# EasyEDA Pro project ProPrj_无线即时通信_2025-03-31.epro, board 主控板
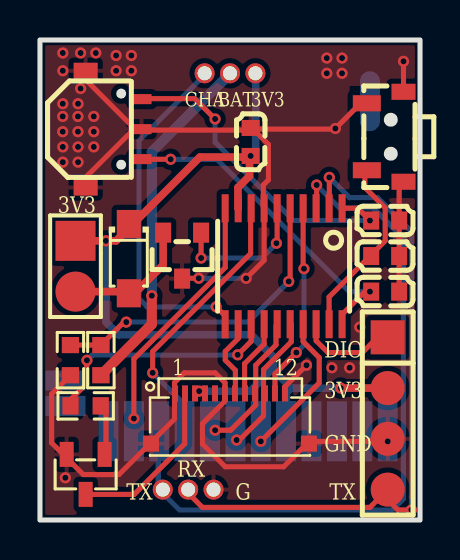
[diagram p6: board, top side]
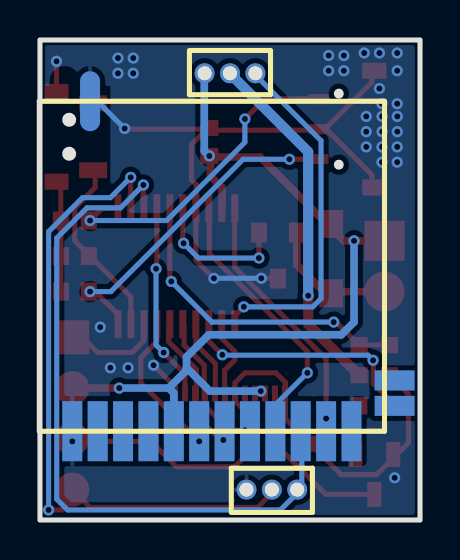
[diagram p7: board, bottom side, seen from below]

Outline 19.02 x 24.02 mm; copper layers: Top Layer, Bottom Layer. Coordinates in mm from the lower left corner of the outline.
Outline path: rectangle 0,24.02 19.02,0
Stack: Top Layer 0.035mm / Dielectric1 0.91mm FR4 er 4.5 / Bottom Layer 0.035mm

## Design rules (mm)
template: JLCPCB Capability(Two Layers Board)
spacing copperThickness1oz (default): track to track 0.102, other pairs 0.152 to 0.3
spacing copperThickness2oz: track to track 0.203, other pairs 0.152 to 0.3
track width copperThickness1oz (default): min 0.127, default 0.254, max 2.54
track width copperThickness2oz: min 0.203, default 0.254, max 2.54
differential pair differentialPair (default): width min 0.127, default 0.254, max 2.54; gap min 0.152, default 0.152
via viaSize (default): diameter min 0.5, default 0.61, max 10; hole min 0.3, default 0.305, max 6.3

## Placement (name value [footprint] x y rotation side)
C2  100nF  [C0603]  10.54 18.92 270 top
C10  100nF  [C0603]  17.27 14.98 0 top
C11  100nF  [C0603]  17.27 11.43 0 top
C56  100nF  [C0603]  17.27 13.2 0 top
D4  DS34W  [SOD-123FL_L2.7-W1.8-LS3.8-RD]  4.44 13.08 270 top
FPC1  AFH34-S12FIA-1H  [FPC-SMD_12P-P0.50_THD0509-12CL-GF]  9.51 5.08 0 top
H1  PZ254V-11-02P  [HDR-TH_2P-P2.54-V-M]  1.78 12.7 270 top
H2  PZ254V-11-04P  [HDR-TH_4P-P2.54-V-M]  17.4 5.33 270 top
Q6  AO3401A  [SOT-23_L2.9-W1.3-P0.95-LS2.4-BR]  7.11 13.23 90 top
R4  100kΩ  [R0603]  3.05 8 270 top
R5  100kΩ  [R0603]  1.52 8 90 top
R62  2.2k  [R0603]  2.29 5.71 0 top
SW3  TS24CA 250gf 013  [SW-SMD_L4.7-W3.5-P3.35-EH]  17.27 19.17 270 top
U1  CH32V003F4P6(TSSOP20)  [OLIMEX_IC-FP:TSSOP20_Pitch-0.65mm_6.6x4.5x1.2mm]  12.19 12.7 180 top
U23  -  [e5e8]  2.54 19.56 90 top
U24  XL1278-SMT  [SX1278]  10.41 12.7 180 bottom
U25  SS8050  [SOT-23-3_L2.9-W1.3-P1.90-LS2.4-BR]  2.29 2.28 90 top
U33  1271WV-3P  [HDR-TH_3P-P1.27-V-M]  9.51 22.35 0 bottom
U34  1271WV-3P  [HDR-TH_3P-P1.27-V-M]  7.41 1.52 180 bottom

## Footprints (pads in the part's own frame, mm; a bottom-side part is the same pattern mirrored in y, then rotated)
C0603
  rect 0.8x0.9 smd: 1(-0.7,0) 2(0.7,0)
e5e8
  rect 0.5x1 smd: 1(-1.5,-2.54) 2(0,-2.54) 3(1.5,-2.54)
  rect 0.8x1.2 smd: 4(-2.921,0.254) 5(2.921,0.254)
FPC-SMD_12P-P0.50_THD0509-12CL-GF
  rect 0.3x0.8 smd: 1(-2.75,1.254) 2(-2.25,1.256) 3(-1.75,1.256) 4(-1.25,1.256) 5(-0.75,1.256) 6(-0.25,1.256) 7(0.25,1.254) 8(0.75,1.256) 9(1.25,1.256) 10(1.75,1.256) 11(2.25,1.256) 12(2.75,1.256)
  rect 0.8x0.8 smd: 13(3.95,-1.256) 14(-3.95,-1.256)
HDR-TH_2P-P2.54-V-M
  rect 2x2 smd: 1(-1.27,0)
  round 2 smd: 2(1.27,0)
HDR-TH_3P-P1.27-V-M
  round 1 hole 0.7: 1(-1.27,0) 2(0,0) 3(1.27,0)
HDR-TH_4P-P2.54-V-M
  rect 1.7x1.7 smd: 1(-3.81,0)
  round 1.7 smd: 2(-1.27,0) 3(1.27,0) 4(3.81,0)
OLIMEX_IC-FP:TSSOP20_Pitch-0.65mm_6.6x4.5x1.2mm
  rect 0.35x1.4 smd: 1(-2.925,-2.9) 2(-2.275,-2.9) 3(-1.625,-2.9) 4(-0.975,-2.9) 5(-0.325,-2.9) 6(0.325,-2.9) 7(0.975,-2.9) 8(1.625,-2.9) 9(2.275,-2.9) 10(2.925,-2.9) 11(2.925,2.9) 12(2.275,2.9) 13(1.625,2.9) 14(0.975,2.9) 15(0.325,2.9) 16(-0.325,2.9) 17(-0.975,2.9) 18(-1.625,2.9) 19(-2.275,2.9) 20(-2.925,2.9)
R0603
  rect 0.806x0.864 smd: 1(-0.753,0) 2(0.753,0)
SOD-123FL_L2.7-W1.8-LS3.8-RD
  rect 1.4x1.2 smd: 1(-1.735,0) 2(1.735,0)
SOT-23-3_L2.9-W1.3-P1.90-LS2.4-BR
  rect 1.25x0.7 smd: 1(1,-0.95) 2(1,0.95) 3(-1,0)
SOT-23_L2.9-W1.3-P0.95-LS2.4-BR
  rect 1x0.8 smd: 1(1.15,-0.95) 2(1.15,0.95) 3(-1.15,0)
SW-SMD_L4.7-W3.5-P3.35-EH
  rect 0.8x1.4 smd: 1(-1.675,-0.917) 2(1.675,-0.917)
  rect 0.8x1.2 smd: 3(-2.25,0.917) 4(2.25,0.917)
SX1278
  rect 1x3 smd: 1(-6.985,-8.255) 2(-5.715,-8.255) 3(-4.445,-8.255) 4(-3.175,-8.255) 5(-1.905,-8.255) 6(-0.635,-8.255) 7(0.635,-8.255) 8(1.905,-8.255) 9(3.175,-8.255) 10(4.445,-8.255) 11(5.715,-8.255) 12(6.985,-8.255)
  rect 2x1 smd: 13(9.144,-6.985) 14(9.144,-5.715)
  oval 1x3 smd: 16(-6.096,8.255)

## Nets
3V3: C2.2 D4.1 FPC1.3 FPC1.4 H1.1 H2.2 U1.9 U24.5 U33.3
GND: C2.1 C10.2 C11.2 C56.2 FPC1.1 FPC1.5 FPC1.6 FPC1.12 FPC1.13 FPC1.14 H2.3 Q6.3 R5.1 SW3.1 SW3.3 SW3.4 U1.7 U23.2 U23.4 U23.5 U24.1 U24.12 U24.16 U25.2 U34.1
VIN: U1.11 U33.1
BATTERY: R4.1 R5.2 U1.5
BVIN+: R4.2 U33.2
D+: U1.3 U24.10 U34.3
D-: H2.4 U1.2 U34.2
EN_MOTOR: Q6.1 U1.6
LEDK: FPC1.2 U25.3
LORA_CS: U1.8 U24.9
LORA_RST: U1.10 U24.11
MISO: U1.17 U24.6
MOSI: FPC1.10 U1.16 U24.7
SCL: FPC1.9 U1.15 U24.8
SCREEN_BL: R62.1 U1.13
SCREEN_CS: FPC1.8 U1.14
SCREEN_DC: FPC1.7 U1.12
SCREEN_RST: FPC1.11 U1.4
SW: C56.1 SW3.2 U1.19
SWA: C10.1 U1.1 U23.3
SWB: C11.1 U1.20 U23.1
SWIO: H2.1 U1.18
$1N1346: D4.2 H1.2 Q6.2
$1N4201: R62.2 U25.1

Pads without a net: U24 2 3 4 13 14

## Via types
v1: diameter 0.559, hole 0.305, Top Layer to Bottom Layer, 62 vias

## Routing (per net, layer and track width the routed paths; a pad name or vN(x,y) marks a point on that pad's centre or on a via; arc(x,y) is an arc through that point)
3V3: length 44.6
  Top Layer w0.254: FPC1.4 FPC1.3
  Top Layer w0.381: H1.1 v1(3.3,13.97) 3.81,13.97 8,18.16 10.48,18.16 ; v1(10.54,18.22) 10.48,18.16 ; 10.48,18.16 10.48,17.21 9.91,16.63 9.91,15.61 U1.9 ; H2.2 v1(15.05,6.6)
  Bottom Layer w0.381: 11.68,7.62 11.68,7.49 12.57,6.6 ; 11.68,7.62 11.68,8.16 10.57,9.27 3.94,9.27 3.3,9.9 v1(3.3,13.97) ; 11.68,7.62 10.52,6.45 v1(7.97,6.45) ; v1(10.54,18.22) 10.8,18.47 10.8,22.46 ; 12.57,6.6 12.32,6.35 U24.5 ; 12.57,6.6 v1(15.05,6.6)
GND: length 72.7
  Top Layer w0.254: Q6.3 7.13,12.1 v1(7.94,12.1) ; U23.2 5.13,19.5 10.43,19.5 C2.1 ; C2.1 10.6,19.56 10.67,19.56 ; C2.1 10.61,19.61 10.67,19.56 ; 10.67,19.56 14.75,19.56 v1(14.78,19.59) 16.04,20.85 SW3.1 ; 10.67,19.56 11.43,18.79 11.43,17.02 11.18,16.76 11.18,15.64 ; SW3.3 v1(18.19,22.95) ; C11.2 C56.2 C10.2 17.97,16.71 SW3.4 ; v1(17.4,3.93) 13.46,3.93 12.19,2.66 9.27,2.66 8.13,3.81 8.13,4.82 9.26,5.95 FPC1.6 9.26,6.87 8.76,7.36 7.22,7.36 6.73,6.88 6.73,5.06 3.95,2.27 2.17,2.27 0.58,3.86 0.58,6.3 R5.1 ; 2.41,22.48 2.41,21.9 4.73,19.58 2.41,17.27 2.41,16.63 ; v1(13.34,7.74) 12.26,6.67 12.26,6.46 ; v1(10.31,12.09) 11.22,12.99 U1.7
  Bottom Layer w0.254: v1(14.78,19.59) 16.15,20.95 U24.16 ; v1(7.94,12.1) 10.31,12.1 v1(10.31,12.09)
  vias: v1(1.14,23.36) v1(1.14,22.48) v1(1.14,20.83) v1(1.14,20.19) v1(1.14,19.43) v1(1.14,18.67) v1(1.14,17.9) v1(1.27,2.11) v1(1.91,20.83) v1(1.9,20.19) v1(1.9,19.43) v1(1.91,18.67) v1(1.91,17.9) v1(2.03,23.36) v1(2.03,21.59) v1(2.69,20.19) v1(2.69,19.43) v1(2.69,18.67) v1(2.79,23.36) v1(3.81,23.24) v1(3.81,22.48) v1(4.57,23.24) v1(4.57,22.48) v1(14.35,23.11) v1(14.35,22.35) v1(14.6,7.62) v1(15.11,23.11) v1(15.11,22.35) v1(15.49,7.62) v1(16,9.65)
VIN: length 17.7
  Top Layer w0.254: U1.11 9.27,10.21 v1(8.82,10.67)
  Bottom Layer w0.254: v1(8.82,10.67) 5.37,10.67 4.95,11.08 4.95,18.98 8.25,22.28
BATTERY: length 15.9
  Top Layer w0.254: R5.2 R4.1 4.2,9.9 v1(4.32,9.9) ; v1(12.45,11.94) 12.52,12.01 U1.5
  Bottom Layer w0.254: v1(4.32,9.9) 10.41,9.9 v1(12.45,11.94)
BVIN+: length 17.8
  Top Layer w0.508: v1(5.6,11.22) 5.6,9.79 R4.2
  Bottom Layer w0.508: v1(5.6,11.22) 5.6,18.42 9.53,22.35
D+: length 35.4
  Top Layer w0.254: v1(13.84,16.76) 13.84,15.7
  Bottom Layer w0.254: 5.97,4.44 5.92,4.39 5.92,1.57 6.99,0.5 17.63,0.5 18.18,1.05 18.18,14.11 16.66,15.62 14.99,15.62 v1(13.84,16.76)
D-: length 33.5
  Top Layer w0.254: v1(18.58,0.5) 17.91,0.5 17.4,1.01 H2.4 16.51,0.63 8.13,0.63 7.24,1.52 ; v1(14.48,17.14) 14.48,15.61 U1.2
  Bottom Layer w0.254: v1(18.58,0.5) 18.58,14.43 16.89,16.13 15.49,16.13 v1(14.48,17.14)
EN_MOTOR: length 7.1
  Top Layer w0.254: U1.6 11.87,13.85 v1(11.83,13.85) ; Q6.1 v1(8.06,13.11)
  Bottom Layer w0.254: v1(11.83,13.85) 11.09,13.11 v1(8.06,13.11)
LEDK: length 8.7
  Top Layer w0.254: U25.3 4.72,1.28 7.24,3.81 7.24,6.44 7.26,6.46
LORA_CS: length 13.9
  Top Layer w0.254: v1(5.64,7.36) 5.64,8.43 10.54,13.33 10.54,15.57 U1.8
  Bottom Layer w0.254: U24.9 7.16,4.52 7.16,5.84 v1(5.64,7.36)
LORA_RST: length 12.4
  Top Layer w0.254: U1.10 9.27,15.59 9.27,12.63 4.7,8.06 v1(4.7,5.08)
MISO: length 7.4
  Top Layer w0.254: v1(11.05,3.93) 13.97,6.86 13.97,8.12 13.17,8.93 U1.17
MOSI: length 7
  Top Layer w0.254: 12.57,9.8 12.57,8.92 11.19,7.53 11.19,5.22 9.97,4 v1(9.84,4)
SCL: length 6.9
  Top Layer w0.254: 11.81,9.73 11.81,8.76 10.8,7.74 10.8,5.75 9.54,4.49 v1(8.76,4.49)
SCREEN_BL: length 12.1
  Top Layer w0.254: U1.13 10.57,8.94 v1(9.89,8.27) ; R62.1 1.53,6.02 2.34,6.83 2.34,7.76 2.35,7.78 v1(2.35,7.99)
  Bottom Layer w0.254: v1(9.89,8.27) 9.87,8.25 2.6,8.25 v1(2.35,7.99)
SCREEN_CS: length 3.7
  Top Layer w0.254: 10.26,6.46 10.24,6.48 10.24,7.82 11.22,8.8 U1.14
SCREEN_DC: length 3.8
  Top Layer w0.254: U1.12 9.92,9.08 9.27,8.43 9.27,8 9.78,7.49 9.78,6.48 9.76,6.46
SCREEN_RST: length 9.9
  Top Layer w0.254: v1(13.21,12.57) 13.17,12.61 U1.4 ; FPC1.11 11.76,7.31 v1(12.83,8.38)
  Bottom Layer w0.254: v1(12.83,8.38) 13.21,8.76 v1(13.21,12.57)
SW: length 9.1
  Top Layer w0.254: 16.35,17.25 16.26,17.25 16.26,16.63 17.27,15.62 17.27,13.97 14.47,11.16 U1.19
SWA: length 16.6
  Top Layer w0.254: v1(16.51,14.98) 15.9,15.6 15.12,15.6 ; 4.77,21.08 7.75,21.08 v1(8.76,20.06)
  Bottom Layer w0.254: v1(16.51,14.98) 12.68,14.98 8.76,18.9 v1(8.76,20.06)
SWB: length 16.5
  Top Layer w0.254: 15.12,9.8 15.11,9.8 15.11,10.28 16.26,11.43 v1(16.51,11.43) ; v1(6.54,18.05) 5.09,18.05 U23.1
  Bottom Layer w0.254: v1(16.51,11.43) 15.47,11.43 8.85,18.05 v1(6.54,18.05)
SWIO: length 5
  Top Layer w0.254: H2.1 16.89,9.14 16.13,8.38 14.41,8.38 13.82,8.97 U1.18
$1N1346: length 6.3
  Top Layer w0.381: 2.03,11.43 4.83,11.43 6.16,12.76 Q6.2
$1N4201: length 2.6
  Top Layer w0.254: U25.1 3.3,3.35 3.3,5.45 R62.2

## Copper pours and planes (outline as drawn; the poured copper is in the pictures)
GND on Top Layer: -2.03,24.76 21.34,24.76 21.34,-4.83 -2.03,-4.83
GND on Bottom Layer: -4.19,24.64 20.19,24.64 20.19,-4.19 -4.19,-4.19

## Text on the board
Top Silkscreen Layer: CHA | BAT | 3V3 | TX | 1 | RX | G | 12 | DIO | GND
